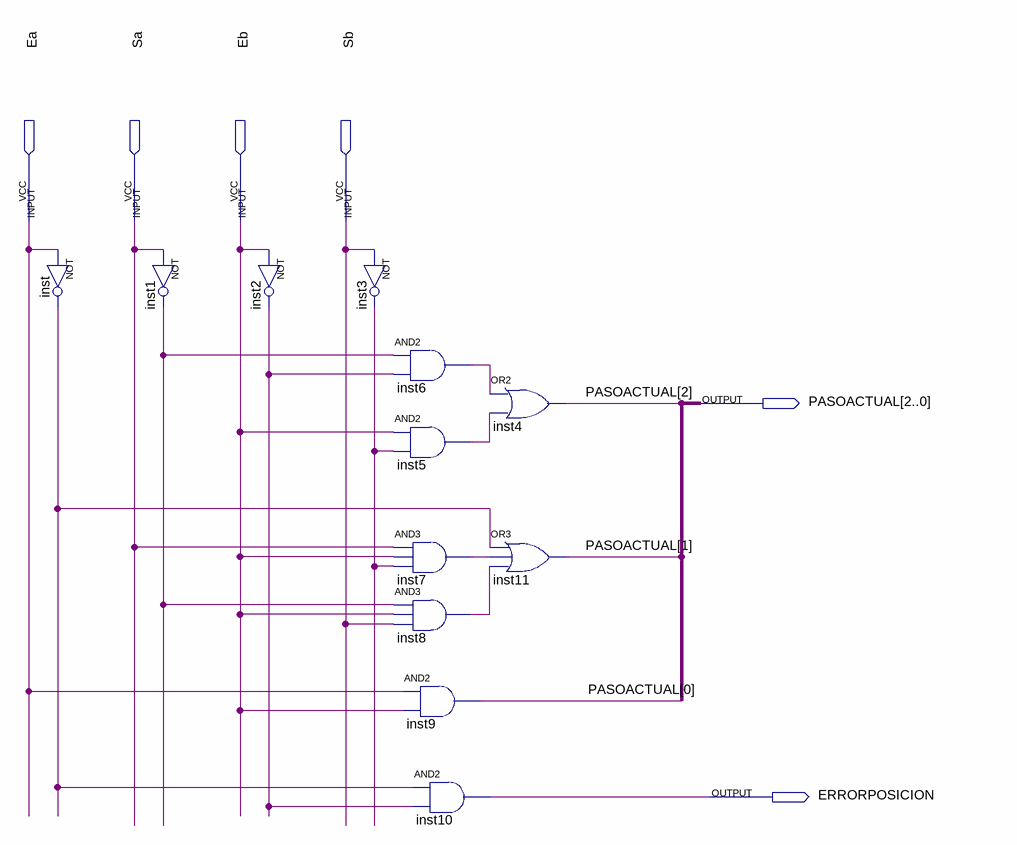
[diagram p0: schematic sheet]
// Quartus schematic ENCODER.bdf as structural Verilog: 12 symbols, 6 pins
module ENCODER (
  input  Ea,
  input  Sa,
  input  Eb,
  input  Sb,
  output [2:0] PASOACTUAL,
  output ERRORPOSICION
);

  wire inst1_out, inst2_out, inst3_out, inst5_out, inst6_out, inst7_out, inst8_out, inst_out;

  not inst (inst_out, Ea);
  not inst1 (inst1_out, Sa);
  not inst2 (inst2_out, Eb);
  not inst3 (inst3_out, Sb);
  and inst6 (inst6_out, inst1_out, inst2_out);
  and inst5 (inst5_out, Eb, inst3_out);
  and inst7 (inst7_out, Sa, Eb, inst3_out);
  and inst8 (inst8_out, inst1_out, Eb, Sb);
  and inst9 (PASOACTUAL[0], Ea, Eb);
  and inst10 (ERRORPOSICION, inst_out, inst2_out);
  or inst4 (PASOACTUAL[2], inst6_out, inst5_out);
  or inst11 (PASOACTUAL[1], inst_out, inst7_out, inst8_out);
endmodule
